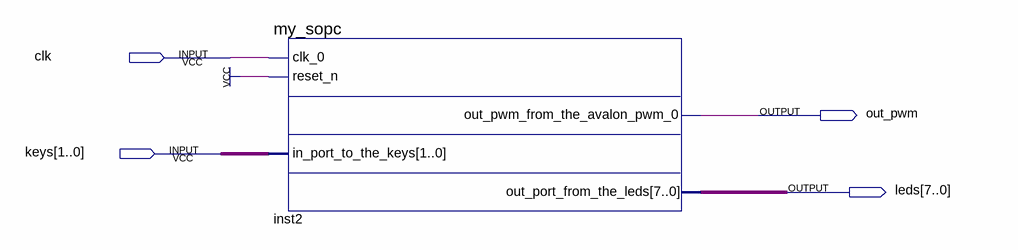
[diagram p0: schematic sheet]
// Quartus schematic sopc_compteur.bdf as structural Verilog: 1 symbols, 4 pins
module sopc_compteur (
  input  clk,
  input  [1:0] keys,
  output out_pwm,
  output [7:0] leds
);

  my_sopc inst2 (
    .clk_0(clk), .reset_n(1'b1), .in_port_to_the_keys(keys), .out_pwm_from_the_avalon_pwm_0(out_pwm),
    .out_port_from_the_leds(leds));
endmodule
